# Altium schematic sheet can_tcan1462v.SchDoc
size A
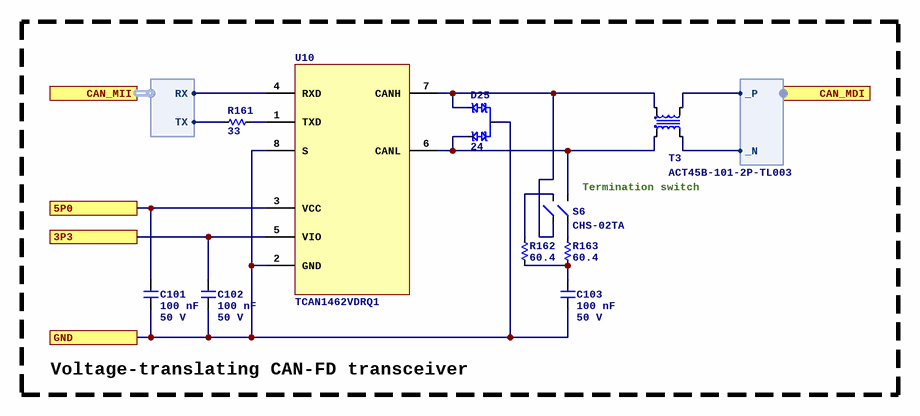
[diagram p0: can_tcan1462v.SchDoc]

## Parts
C101  Capacitance: 100 nF  Voltage Rating: 50 V  [C0402]  (hidden comment: CL05B104KB54PNC)
C102  Capacitance: 100 nF  Voltage Rating: 50 V  [C0402]  (hidden comment: CL05B104KB54PNC)
C103  Capacitance: 100 nF  Voltage Rating: 50 V  [C0402]  (hidden comment: CL05B104KB54PNC)
D25  Standoff (V): 24  [3SOT23]  (hidden comment: PESD2CAN,215)
R161  value 33  [R0402]  (hidden comment: 0402WGF330JTCE)
R162  value 60.4  [R0402]  (hidden comment: FRC0402F60R4TS)
R163  value 60.4  [R0402]  (hidden comment: FRC0402F60R4TS)
S6  CHS-02TA  [SWITCH_NIDEC_CHS-02TA]
T3  ACT45B-101-2P-TL003  [CHOKE_ACT45B-101-2P-TL003]
U10  TCAN1462VDRQ1  [8SOIC150]

## Ports
3P3, 5P0, CAN_MDI (harness DIFF), CAN_MII (harness CAN), GND

## Harnesses
CAN: TX, RX
DIFF: _P, _N

## Nets
3P3: C102.1 U10.5(VIO) ; port 3P3
5P0: C101.1 U10.3(VCC) ; port 5P0
GND: C101.2 C102.2 C103.2 D25.3 U10.2(GND) U10.8(S) ; port GND
NetC103_1: C103.1 R162.2 R163.1
NetD25_1: D25.1 S6.1 T3.1 U10.7(CANH)
NetD25_2: D25.2 S6.4 T3.2 U10.6(CANL)
NetR161_1: R161.1 ; port CAN_MII.TX
NetR161_2: R161.2 U10.1(TXD)
NetR162_1: R162.1 S6.2
NetR163_2: R163.2 S6.3
NetT3_3: T3.3 ; port CAN_MDI._N
NetT3_4: T3.4 ; port CAN_MDI._P
NetU10_4: U10.4(RXD) ; port CAN_MII.RX

## Notes on the sheet
- (near S6) Termination switch
- Voltage-translating CAN-FD transceiver

## Library data of the parts
C101-C103 = CL05B104KB54PNC: Manufacturer: Samsung Electro-Mechanics; Dielectric: X7R; ComponentLink1URL: https://wmsc.lcsc.com/wmsc/upload/file/pdf/v2/lcsc/2304140030_Samsung-Electro-Mechanics-CL05B104KB54PNC_C307331.pdf; ComponentLink1Description: Datasheet; Manufacturer Part Number: CL05B104KB54PNC; Package: 0402; Supplier 2: LCSC; Supplier Part Number 2: C307331
D25 = PESD2CAN,215: DIODE ESD CAN SOT-23; Manufacturer: NXP Semiconductors; Polarity: Bidirectional; Capacitance (pF): 30; Min Breakdown Voltage: 26.2 V; Clamping Voltage-Max: 41 V; Power (W): 230; Supplier 1: DigiKey; ComponentLink1URL: https://assets.nexperia.com/documents/data-sheet/PESD2CAN.pdf; ComponentLink1Description: Datasheet; Supplier Part Number 1: 1727-3891-1-ND; Manufacturer Part Number: PESD2CAN,215; Supplier 2: LCSC; Supplier Part Number 2: C75176; Supplier 3: Mouser; Supplier Part Number 3: 771-PESD2CAN-T/R
R161 = 0402WGF330JTCE: Manufacturer: UNI-ROYAL(Uniroyal Elec); Tolerance: 1%; Temperature Coefficient: ±100ppm/?; Power Rating (mW): 62.5; ComponentLink1Description: Datasheet; ComponentLink1URL: https://wmsc.lcsc.com/wmsc/upload/file/pdf/v2/lcsc/2205311900_UNI-ROYAL-Uniroyal-Elec-0402WGF330JTCE_C25105.pdf; Manufacturer Part Number: 0402WGF330JTCE; Package: 0402; Supplier 2: LCSC; Supplier Part Number 2: C25105
R162 R163 = FRC0402F60R4TS: Manufacturer: FOJAN; Tolerance: 1%; Temperature Coefficient: ±100ppm/?; Power Rating (mW): 62.5; ComponentLink1Description: Datasheet; ComponentLink1URL: https://datasheet.lcsc.com/lcsc/2308241947_FOJAN-FRC0402F60R4TS_C2960873.pdf; Manufacturer Part Number: FRC0402F60R4TS; Package: 0402; Supplier 2: LCSC; Supplier Part Number 2: C2960873
S6 = CHS-02TA: DIP Switch, Slide, SPST, Flush, Recessed, 6VDC, 100mA, CHS Series Ž Nidec Components CHS-02TA; Manufacturer: Nidec Copal; Supplier 1: DigiKey; Supplier Part Number 1: 563-1005-1-ND; Manufacturer Part Number: CHS-02TA; Supplier 2: LCSC; Supplier Part Number 2: C2921606; ComponentLink1Description: Datasheet; ComponentLink1URL: https://www.nidec-components.com/e/catalog/switch/chs.pdf; Supplier 3: Mouser; Supplier Part Number 3: 229-CHS-02TA
T3 = ACT45B-101-2P-TL003: CHOKE COMMON MODE 5000 OHM SMD; Manufacturer: TDK Corporation; Supplier 1: DigiKey; Manufacturer Part Number: ACT45B-101-2P-TL003; ComponentLink1URL: http://www.tdk.co.jp/tefe02/e9711_act.pdf; ComponentLink1Description: Datasheet; Supplier Part Number 1: 445-3959-1-ND; Supplier 2: LCSC; Supplier Part Number 2: C88056; Supplier 3: Mouser; Supplier Part Number 3: 810-ACT45B1012PTL003
U10 = TCAN1462VDRQ1: Automotive signal improvement CAN FD transceiver with VIO and standby 8-SOIC -40 to 125; Manufacturer: Texas Instruments; Supplier 1: DigiKey; Supplier Part Number 1: 296-TCAN1462VDRQ1CT-ND; Manufacturer Part Number: TCAN1462VDRQ1; ComponentLink1Description: Datasheet; ComponentLink1URL: https://www.ti.com/lit/ds/symlink/tcan1462-q1.pdf; Supplier 2: LCSC; Supplier Part Number 2: C7399456; Supplier 3: Mouser; Supplier Part Number 3: 595-TCAN1462VDRQ1